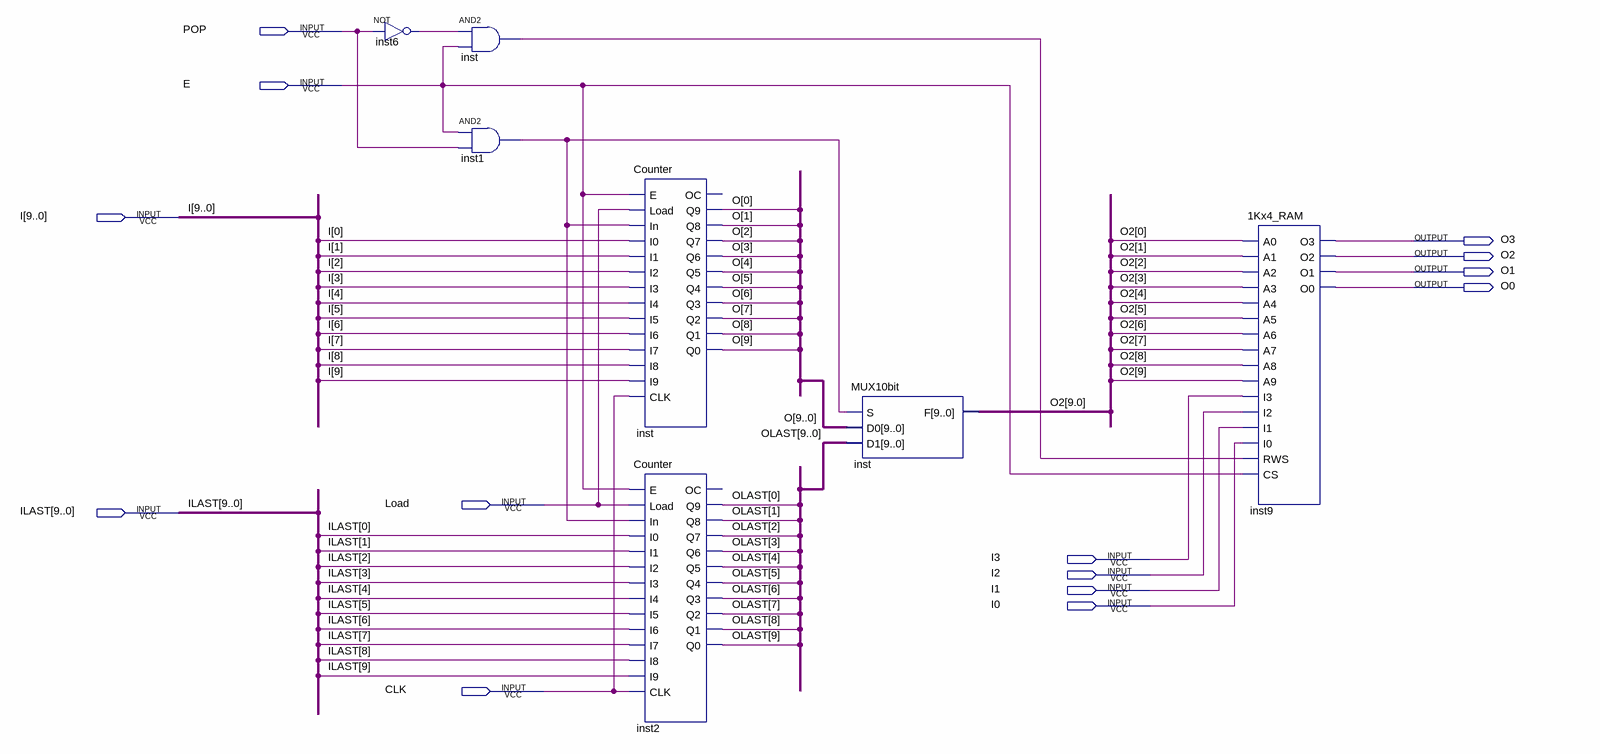
[diagram p0: schematic sheet]
// Quartus schematic STACK.bdf as structural Verilog: 7 symbols, 14 pins
module STACK (
  input  POP,
  input  E,
  input  [9:0] I,
  input  Load,
  input  [9:0] ILAST,
  input  I3,
  input  I2,
  input  I1,
  input  I0,
  input  CLK,
  output O3,
  output O2,
  output O1,
  output O0
);

  wire inst1_out, inst6_out, inst_out, \O2[9.0] ;
  wire [9:0] O2_bus, OLAST;
  wire [9:4] O;

  not inst6 (inst6_out, POP);
  and inst (inst_out, inst6_out, E);
  and inst1 (inst1_out, E, POP);
  Counter inst_dup2 (
    .E(E), .Load(Load), .In(inst1_out), .I0(I[0]), .I1(I[1]), .I2(I[2]), .I3(I[3]), .I4(I[4]), .I5(I[5]),
    .I6(I[6]), .I7(I[7]), .I8(I[8]), .I9(I[9]), .CLK(CLK), .Q9(O0), .Q8(O1), .Q7(O2), .Q6(O3), .Q5(O[4]),
    .Q4(O[5]), .Q3(O[6]), .Q2(O[7]), .Q1(O[8]), .Q0(O[9]));  // open: OC
  Counter inst2 (
    .E(E), .Load(Load), .In(inst1_out), .I0(ILAST[0]), .I1(ILAST[1]), .I2(ILAST[2]), .I3(ILAST[3]),
    .I4(ILAST[4]), .I5(ILAST[5]), .I6(ILAST[6]), .I7(ILAST[7]), .I8(ILAST[8]), .I9(ILAST[9]), .CLK(CLK),
    .Q9(OLAST[0]), .Q8(OLAST[1]), .Q7(OLAST[2]), .Q6(OLAST[3]), .Q5(OLAST[4]), .Q4(OLAST[5]), .Q3(OLAST[6]),
    .Q2(OLAST[7]), .Q1(OLAST[8]), .Q0(OLAST[9]));  // open: OC
  MUX10bit inst_dup3 (.S(inst1_out), .D0({O, O3, O2, O1, O0}), .D1(OLAST), .F(\O2[9.0] ));
  \1Kx4_RAM  inst9 (
    .A0(O2_bus[0]), .A1(O2_bus[1]), .A2(O2_bus[2]), .A3(O2_bus[3]), .A4(O2_bus[4]), .A5(O2_bus[5]),
    .A6(O2_bus[6]), .A7(O2_bus[7]), .A8(O2_bus[8]), .A9(O2_bus[9]), .I3(I3), .I2(I2), .I1(I1), .I0(I0),
    .RWS(inst_out), .CS(E), .O3(O3), .O2(O2), .O1(O1), .O0(O0));
endmodule
